# EAGLE design maple-jtagadapter-xkn (EAGLE 5.10)
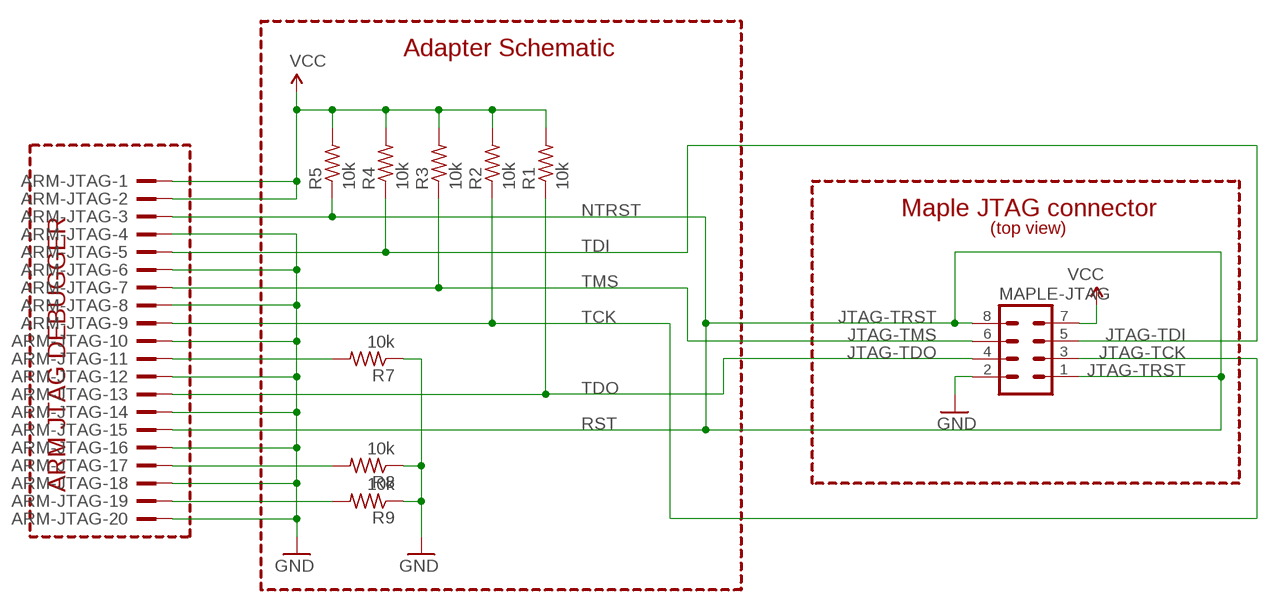
[diagram p0: schematic, sheet 1]

## Parts
ARM-JTAG  2520-  [PAK100/2500-20]
MAPLE-JTAG  MA04-2  [MA04-2]
R1  10k  R-US_0207/10  [0207/10]
R2  10k  R-US_0207/10  [0207/10]
R3  10k  R-US_0207/10  [0207/10]
R4  10k  R-US_0207/10  [0207/10]
R5  10k  R-US_0207/10  [0207/10]
R7  10k  R-US_0207/10  [0207/10]
R8  10k  R-US_0207/10  [0207/10]
R9  10k  R-US_0207/10  [0207/10]

## Nets
GND [vcc]: ARM-JTAG.4 ARM-JTAG.6 ARM-JTAG.8 ARM-JTAG.10 ARM-JTAG.12 ARM-JTAG.14 ARM-JTAG.16 ARM-JTAG.18 ARM-JTAG.20 MAPLE-JTAG.2 R7.1 R8.1 R9.1
JTAG-TCK: ARM-JTAG.9 MAPLE-JTAG.3 R2.1
JTAG-TDI: ARM-JTAG.5 MAPLE-JTAG.5 R4.1
JTAG-TDO: ARM-JTAG.13 MAPLE-JTAG.4 R1.1
JTAG-TMS: ARM-JTAG.7 MAPLE-JTAG.6 R3.1
JTAG-TRST: ARM-JTAG.3 ARM-JTAG.15 MAPLE-JTAG.1 MAPLE-JTAG.8 R5.1
N$140: ARM-JTAG.11 R7.2
N$141: ARM-JTAG.17 R8.2
N$142: ARM-JTAG.19 R9.2
VCC: ARM-JTAG.1 ARM-JTAG.2 MAPLE-JTAG.7 R1.2 R2.2 R3.2 R4.2 R5.2

## Notes on the sheet
- Adapter Schematic
- ARM JTAG DEBUGGER | NTRST | Maple JTAG connector
- (top view)
- TDI
- TMS
- TCK
- TDO
- RST

## Library data of the parts
ARM-JTAG = con-3m:2520-: 3M (TM) Pak 100 4-Wall Header Source: 3M
MAPLE-JTAG = con-lstb:MA04-2: PIN HEADER
R1-R5 R7-R9 = resistor:R-US_: RESISTOR, American symbol

## Net classes
0 default: width 0.203 mm
1 vcc: width 0.254 mm

## Board
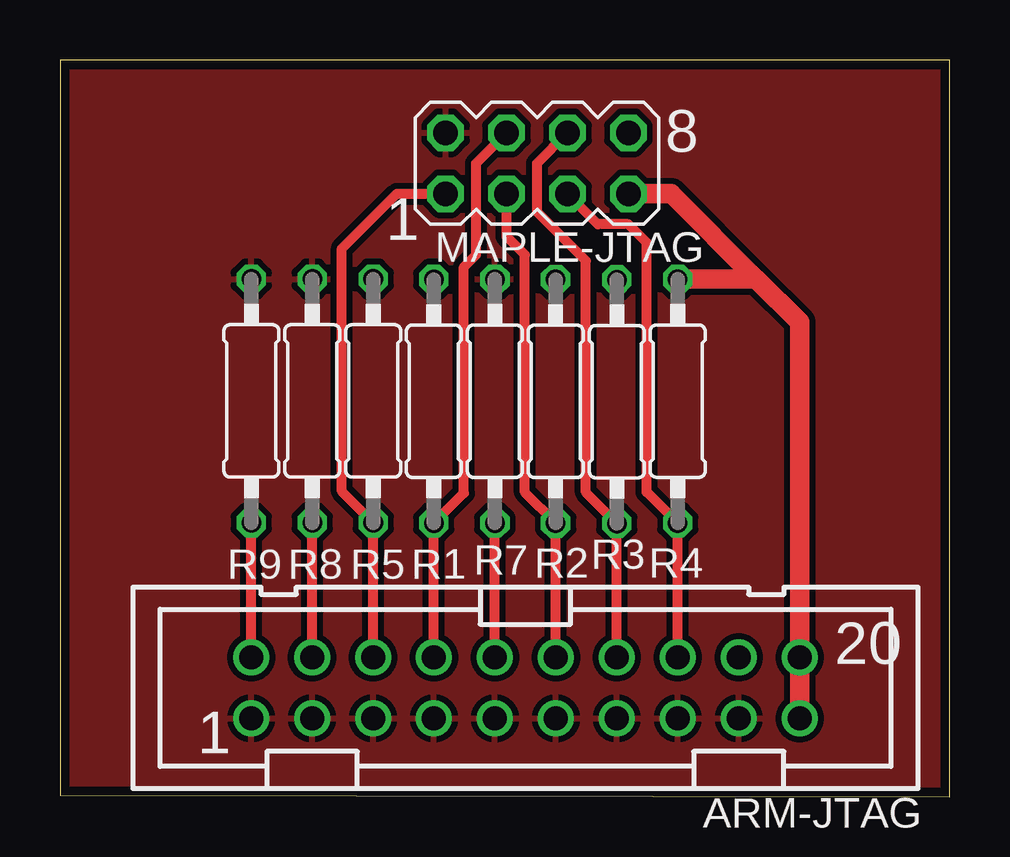
[diagram p1: board, top side]
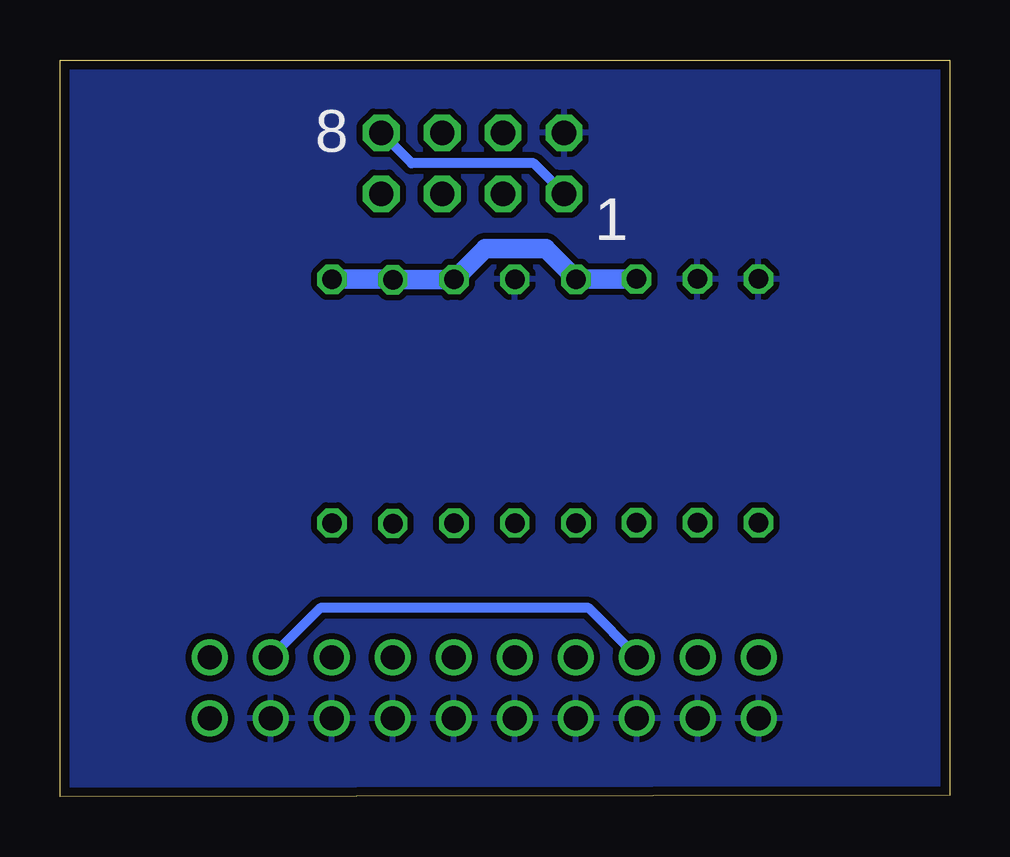
[diagram p2: board, bottom side, seen from below]

Size 37.07 x 30.72 mm. Coordinates in mm from the lower left corner, seen from the top.
Outline: 0,0.06 37.07,0 37.07,30.72 0,30.72 0,0.06
Copper layers (1*16): Top 0.0356mm / dielectric 1.5011mm / Bottom 0.0356mm
Design rules "LaenPCBOrder": minimum track width 6mil, minimum drill 13mil, track to track 6mil, track to pad 6mil, pad to pad 6mil, via to via 6mil, smd to smd 6mil, copper to edge 15mil, drill to drill 6mil, minimum pad ring 7mil, minimum via ring 7mil, stop-mask expansion 4mil, vias tented up to drill 0mil, thermal gap 10mil

### Footprints (pad centres in the part's own frame; a part is rotated, then mirrored left to right if it is on the bottom)
PAK100/2500-20 = drill 1 pad 1.422 round: 1 -11.43,-1.27; 2 -11.43,1.27; 3 -8.89,-1.27; 4 -8.89,1.27; 5 -6.35,-1.27; 6 -6.35,1.27; 7 -3.81,-1.27; 8 -3.81,1.27; 9 -1.27,-1.27; 10 -1.27,1.27; 11 1.27,-1.27; 12 1.27,1.27; 13 3.81,-1.27; 14 3.81,1.27; 15 6.35,-1.27; 16 6.35,1.27; 17 8.89,-1.27; 18 8.89,1.27; 19 11.43,-1.27; 20 11.43,1.27
MA04-2 = drill 1.016 octagon: 1 -3.81,-1.27; 2 -3.81,1.27; 3 -1.27,-1.27; 4 -1.27,1.27; 5 1.27,-1.27; 6 1.27,1.27; 7 3.81,-1.27; 8 3.81,1.27
0207/10 = drill 0.813 octagon: 1 -5.08,0; 2 5.08,0

### Placement (x,y rotation side)
ARM-JTAG  19.39,4.55 180 top
MAPLE-JTAG  19.88,26.42 0 top
R1  15.57,16.5 90 top
R2  20.65,16.49 90 top
R3  23.2,16.48 90 top
R4  25.74,16.5 90 top
R5  13.05,16.51 90 top
R7  18.12,16.5 270 top
R8  10.51,16.51 270 top
R9  7.97,16.51 270 top

### Tracks (layer width: path | path; a pad name or v marks a point on that pad's centre or on a via)
GND
  pour Top (isolate 0.254): 0.06,30.73 37.15,30.73 37.15,0.25 0.06,0.25
  pour Bottom (isolate 0.254): 0.06,30.73 37.15,30.73 37.15,0 0.06,0
JTAG-TCK
  Top 0.406: ARM-JTAG.9 20.65,5.83 R2.1 19.37,12.7 19.37,22.61 18.61,23.37 MAPLE-JTAG.3
JTAG-TDI
  Top 0.406: ARM-JTAG.5 R4.1 24.45,12.71 24.45,23.11 23.69,23.88 22.42,23.88 MAPLE-JTAG.5
JTAG-TDO
  Top 0.406: ARM-JTAG.13 R1.1 16.83,12.67 16.83,22.1 17.34,22.61 17.34,26.42 MAPLE-JTAG.4
JTAG-TMS
  Top 0.406: ARM-JTAG.7 R3.1 21.91,12.7 21.91,22.35 19.88,24.38 19.88,26.42 MAPLE-JTAG.6 | ARM-JTAG.7
JTAG-TRST
  Top 0.406: MAPLE-JTAG.1 14.03,25.15 11.75,22.86 11.75,12.73 R5.1 ARM-JTAG.15
  Bottom 0.406: MAPLE-JTAG.1 17.34,26.42 22.42,26.42 MAPLE-JTAG.8 | ARM-JTAG.15 13.04,5.87 15.05,7.87 26.23,7.87 ARM-JTAG.3
N$140
  Top 0.406: R7.2 ARM-JTAG.11
N$141
  Top 0.406: R8.2 ARM-JTAG.17
N$142
  Top 0.406: ARM-JTAG.19 7.96,11.42 R9.2
VCC
  Top 0.813: ARM-JTAG.2 ARM-JTAG.1 30.82,19.79 29.02,21.59 | 29.02,21.59 25.75,21.59 R4.2 | MAPLE-JTAG.7 25.46,25.15 29.02,21.59
  Bottom 0.813: R5.2 15.56,21.59 R1.2 15.57,21.61 16.83,22.86 19.36,22.86 R2.2 23.19,21.57 R3.2 23.22,21.58 R4.2

### Text on the board
tNames: 8 | 1 | 20 | 1
bNames: 8 | 1
tValues: Maple | JTAG | Adapter | r1